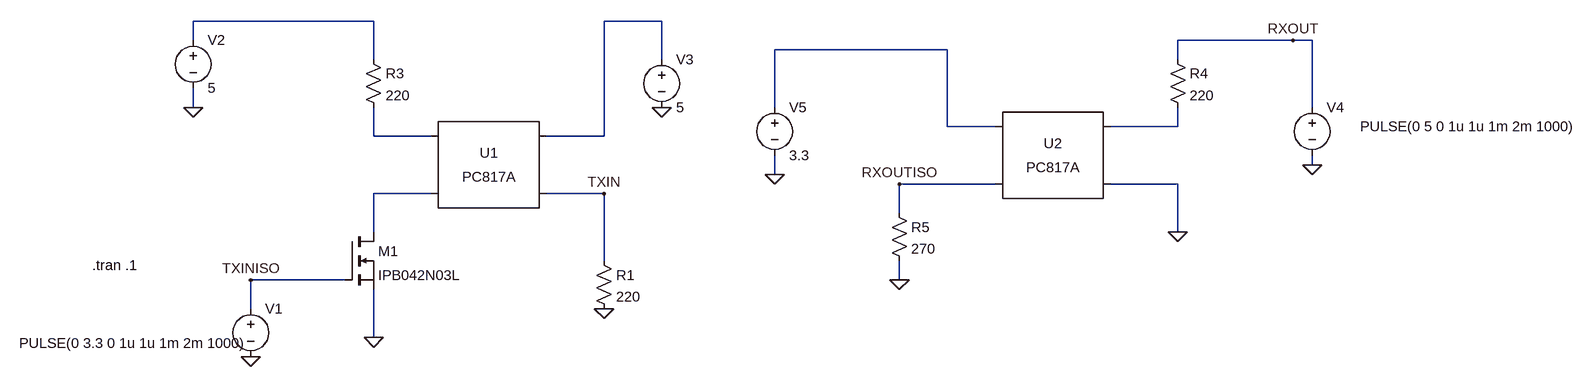
[diagram p0: schematic RS232 ISO.asc]
RS232 ISO.asc, the LTspice schematic file:
Version 4
SHEET 1 3224 680
WIRE 416 -112 32 -112
WIRE 896 -112 800 -112
WIRE 32 -80 32 -112
WIRE 2560 -80 2368 -80
WIRE 2592 -80 2560 -80
WIRE 1984 -64 1696 -64
WIRE 416 -48 416 -112
WIRE 896 -48 896 -112
WIRE 2368 -48 2368 -80
WIRE 32 32 32 0
WIRE 1696 32 1696 -64
WIRE 2592 32 2592 -80
WIRE 1984 64 1984 -64
WIRE 2064 64 1984 64
WIRE 2368 64 2368 32
WIRE 2368 64 2256 64
WIRE 416 80 416 32
WIRE 512 80 416 80
WIRE 800 80 800 -112
WIRE 800 80 704 80
WIRE 2592 128 2592 112
WIRE 1696 144 1696 112
WIRE 2064 160 1904 160
WIRE 2368 160 2256 160
WIRE 512 176 416 176
WIRE 800 176 704 176
WIRE 1904 208 1904 160
WIRE 416 240 416 176
WIRE 2368 240 2368 160
WIRE 800 288 800 176
WIRE 368 320 128 320
WIRE 1904 320 1904 288
WIRE 128 368 128 320
WIRE 416 416 416 336
FLAG 128 448 0
FLAG 416 416 0
FLAG 32 32 0
FLAG 896 32 0
FLAG 800 368 0
FLAG 2368 240 0
FLAG 1696 144 0
FLAG 1904 320 0
FLAG 2592 128 0
FLAG 1904 160 RXOUTISO
FLAG 2560 -80 RXOUT
FLAG 128 320 TXINISO
FLAG 800 176 TXIN
SYMBOL voltage 128 352 R0
WINDOW 3 -386 74 Left 2
WINDOW 123 0 0 Left 0
WINDOW 39 0 0 Left 0
SYMATTR Value PULSE(0 3.3 0 1u 1u 1m 2m 1000)
SYMATTR InstName V1
SYMBOL Optos\\PC817A 608 128 R0
SYMATTR InstName U1
SYMBOL voltage 32 -96 R0
WINDOW 123 0 0 Left 0
WINDOW 39 0 0 Left 0
SYMATTR InstName V2
SYMATTR Value 5
SYMBOL voltage 896 -64 R0
WINDOW 123 0 0 Left 0
WINDOW 39 0 0 Left 0
SYMATTR InstName V3
SYMATTR Value 5
SYMBOL res 784 272 R0
SYMATTR InstName R1
SYMATTR Value 220
SYMBOL nmos 368 240 R0
SYMATTR InstName M1
SYMATTR Value IPB042N03L
SYMBOL voltage 2592 16 R0
WINDOW 3 80 48 Left 2
WINDOW 123 0 0 Left 0
WINDOW 39 0 0 Left 0
SYMATTR Value PULSE(0 5 0 1u 1u 1m 2m 1000)
SYMATTR InstName V4
SYMBOL Optos\\PC817A 2160 112 M0
SYMATTR InstName U2
SYMBOL voltage 1696 16 R0
WINDOW 123 0 0 Left 0
WINDOW 39 0 0 Left 0
SYMATTR InstName V5
SYMATTR Value 3.3
SYMBOL res 400 -64 R0
SYMATTR InstName R3
SYMATTR Value 220
SYMBOL res 2352 -64 R0
SYMATTR InstName R4
SYMATTR Value 220
SYMBOL res 1888 192 R0
SYMATTR InstName R5
SYMATTR Value 270
TEXT -136 296 Left 2 !.tran .1

The netlist it stands for:
* RS232 ISO.asc
V1 TXINISO 0 PULSE(0 3.3 0 1u 1u 1m 2m 1000)
XU1 N005 N006 N002 TXIN PC817 Igain=1m
V2 N001 0 5
V3 N002 0 5
R1 TXIN 0 220
M1 N006 TXINISO 0 0 IPB042N03L
V4 RXOUT 0 PULSE(0 5 0 1u 1u 1m 2m 1000)
XU2 N004 0 N003 RXOUTISO PC817 Igain=1m
V5 N003 0 3.3
R3 N001 N005 220
R4 RXOUT N004 220
R5 RXOUTISO 0 270
.model NMOS NMOS
.model PMOS PMOS
.lib standard.mos
.tran .1
.lib PC817.sub
.backanno
.end